# EAGLE design Extrudrboard (EAGLE 6.1)
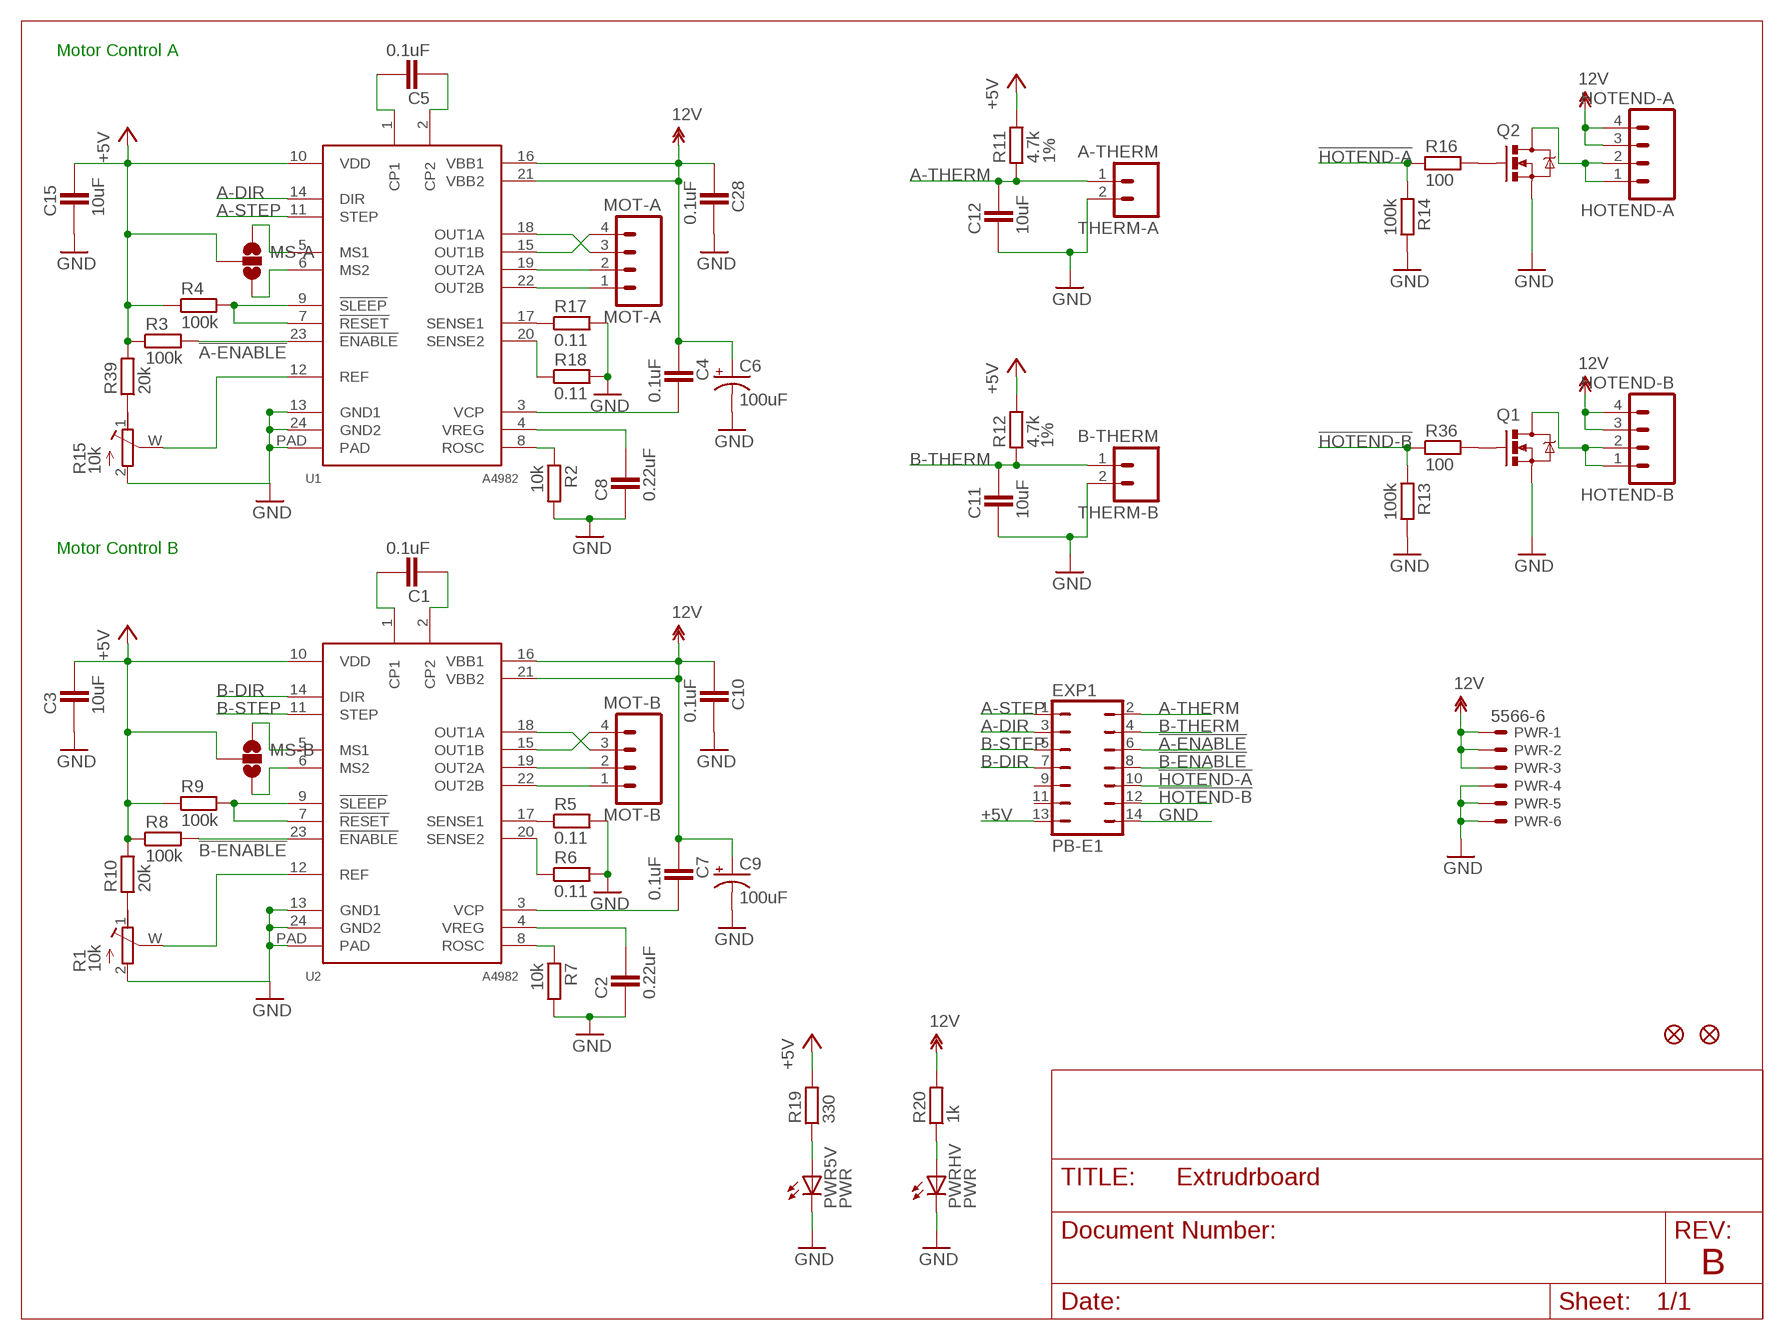
[diagram p0: schematic, sheet 1]

## Parts
C1  0.1uF  CAPACITOR_0805  [CAPC2012X145AN]
C2  0.22uF  CAPACITOR_0805  [CAPC2012X145AN]
C3  10uF  CAPACITOR_0805  [CAPC2012X145AN]
C4  0.1uF  CAPACITOR_0805  [CAPC2012X145AN]
C5  0.1uF  CAPACITOR_0805  [CAPC2012X145AN]
C6  100uF  CPOL-USD  [PANASONIC_D]
C7  0.1uF  CAPACITOR_0805  [CAPC2012X145AN]
C8  0.22uF  CAPACITOR_0805  [CAPC2012X145AN]
C9  100uF  CPOL-USD  [PANASONIC_D]
C10  0.1uF  CAPACITOR_0805  [CAPC2012X145AN]
C11  10uF  CAPACITOR_0805  [CAPC2012X145AN]
C12  10uF  CAPACITOR_0805  [CAPC2012X145AN]
C15  10uF  CAPACITOR_0805  [CAPC2012X145AN]
C28  0.1uF  CAPACITOR_0805  [CAPC2012X145AN]
EXP1  PB-E1  JP7Q  [JP7Q]
HOTEND-A  HOTEND-A  M04POLAR  [MOLEX-1X4]
HOTEND-B  HOTEND-B  M04POLAR  [MOLEX-1X4]
JP1  FIDUCIAL1X2.5  [FIDUCIAL-1X2.5]
JP2  FIDUCIAL1X2.5  [FIDUCIAL-1X2.5]
MOT-A  MOT-A  M04POLAR  [MOLEX-1X4]
MOT-B  MOT-B  M04POLAR  [MOLEX-1X4]
MS-A  SOLDERJUMPER_2WAYCONNECTED  [SJ_3_CONNECTED]
MS-B  SOLDERJUMPER_2WAYCONNECTED  [SJ_3_CONNECTED]
PWR  5566-6  [5566-6]
PWR5V  PWR  LEDCHIP-LED0805  [CHIP-LED0805]
PWRHV  PWR  LEDCHIP-LED0805  [CHIP-LED0805]
Q1  MOSFET-NCHANNELPTH2  [TO220V]
Q2  MOSFET-NCHANNELPTH2  [TO220V]
R1  10k  RTRIM-ST-4EA  [RTRIM-ST4ETB]
R2  10k  RESISTOR_0805  [RESC2012X70N]
R3  100k  RESISTOR_0805  [RESC2012X70N]
R4  100k  RESISTOR_0805  [RESC2012X70N]
R5  0.11  RESISTOR_0805  [RESC2012X70N]
R6  0.11  RESISTOR_0805  [RESC2012X70N]
R7  10k  RESISTOR_0805  [RESC2012X70N]
R8  100k  RESISTOR_0805  [RESC2012X70N]
R9  100k  RESISTOR_0805  [RESC2012X70N]
R10  20k  RESISTOR_0805  [RESC2012X70N]
R11  4.7k  RESISTOR_0805  [RESC2012X70N]
R12  4.7k  RESISTOR_0805  [RESC2012X70N]
R13  100k  RESISTOR_0805  [RESC2012X70N]
R14  100k  RESISTOR_0805  [RESC2012X70N]
R15  10k  RTRIM-ST-4EA  [RTRIM-ST4ETB]
R16  100  RESISTOR_0805  [RESC2012X70N]
R17  0.11  RESISTOR_0805  [RESC2012X70N]
R18  0.11  RESISTOR_0805  [RESC2012X70N]
R19  330  RESISTOR_0805  [RESC2012X70N]
R20  1k  RESISTOR_0805  [RESC2012X70N]
R36  100  RESISTOR_0805  [RESC2012X70N]
R39  20k  RESISTOR_0805  [RESC2012X70N]
THERM-A  A-THERM  M02PTH  [1X02]
THERM-B  B-THERM  M02PTH  [1X02]
U1  A4982  [TSSOP-24]
U2  A4982  [TSSOP-24]

## Nets
12V: C4.1 C6.+ C7.1 C9.+ C10.1 C28.1 HOTEND-A.3 HOTEND-A.4 HOTEND-B.3 HOTEND-B.4 PWR.1 PWR.2 PWR.3 R20.2 U1.16(VBB1) U1.21(VBB2) U2.16(VBB1) U2.21(VBB2)
!A-ENABLE: EXP1.6 R3.2 U1.23(!ENABLE)
!B-ENABLE: EXP1.8 R8.2 U2.23(!ENABLE)
!HOTEND-A: EXP1.10 R14.1 R16.1
!HOTEND-B: EXP1.12 R13.1 R36.1
+5V [power]: C3.2 C15.2 EXP1.13 MS-A.2 MS-B.2 R3.1 R4.1 R8.1 R9.1 R10.2 R11.2 R12.2 R19.2 R39.2 U1.10(VDD) U2.10(VDD)
A-DIR: EXP1.3 U1.14(DIR)
A-STEP: EXP1.1 U1.11(STEP)
A-THERM: C12.2 EXP1.2 R11.1 THERM-A.1
B-DIR: EXP1.7 U2.14(DIR)
B-STEP: EXP1.5 U2.11(STEP)
B-THERM: C11.2 EXP1.4 R12.1 THERM-B.1
GND [power]: C2.1 C3.1 C6.- C8.1 C9.- C10.2 C11.1 C12.1 C15.1 C28.2 EXP1.14 PWR5V.C PWR.4 PWR.5 PWR.6 PWRHV.C Q1.3(S) Q2.3(S) R1.2(E) R2.2 R5.2 R6.2 R7.2 R13.2 R14.2 R15.2(E) R17.2 R18.2 THERM-A.2 THERM-B.2 U1.13(GND1) U1.24(GND2) U1.PAD U2.13(GND1) U2.24(GND2) U2.PAD
HOTENDA-GND [power]: HOTEND-A.1 HOTEND-A.2 Q2.2(D)
HOTENDB-GND [power]: HOTEND-B.1 HOTEND-B.2 Q1.2(D)
N$1: C1.2 U2.1(CP1)
N$2: C1.1 U2.2(CP2)
N$3: R5.1 U2.17(SENSE1)
N$4: R6.1 U2.20(SENSE2)
N$5: R1.W(S) U2.12(REF)
N$6: R7.1 U2.8(ROSC)
N$7: C2.2 U2.4(VREG)
N$8: R9.2 U2.7(!RESET) U2.9(!SLEEP)
N$9: C7.2 U2.3(VCP)
N$10: MOT-A.3 U1.18(OUT1A)
N$11: C5.2 U1.1(CP1)
N$12: C5.1 U1.2(CP2)
N$13: R2.1 U1.8(ROSC)
N$14: R17.1 U1.17(SENSE1)
N$15: R18.1 U1.20(SENSE2)
N$16: C4.2 U1.3(VCP)
N$17: MOT-A.4 U1.15(OUT1B)
N$18: R15.W(S) U1.12(REF)
N$19: C8.2 U1.4(VREG)
N$20: MOT-A.2 U1.19(OUT2A)
N$21: R4.2 U1.7(!RESET) U1.9(!SLEEP)
N$22: MS-B.1 U2.5(MS1)
N$23: MOT-A.1 U1.22(OUT2B)
N$24: MS-B.3 U2.6(MS2)
N$25: MOT-B.3 U2.18(OUT1A)
N$26: MOT-B.4 U2.15(OUT1B)
N$27: MS-A.1 U1.5(MS1)
N$28: MS-A.3 U1.6(MS2)
N$29: MOT-B.2 U2.19(OUT2A)
N$30: MOT-B.1 U2.22(OUT2B)
N$31: R1.1(A) R10.1
N$32: Q2.1(G) R16.2
N$33: PWR5V.A R19.1
N$34: PWRHV.A R20.1
N$69: R15.1(A) R39.1
N$71: Q1.1(G) R36.2
Unconnected: EXP1.9 EXP1.11

## Notes on the sheet
- Motor Control A
- Motor Control B
- B

## Library data of the parts
C1-C5 C7 C8 C10-C12 C15 C28 = ipc-7351-capacitor:CAPACITOR_
C6 C9 = rcl:CPOL-US: POLARIZED CAPACITOR, American symbol
EXP1 = printrbot:JP7Q: JUMPER
HOTEND-A HOTEND-B MOT-A MOT-B = SparkFun:M04: Header 4 Standard 4-pin 0.1" header. Use with straight break away headers (SKU : PRT-00116), right angle break away headers (PRT-00553), swiss pins (PRT-00743), machine pins (PRT-00117), and female headers (PRT-00115). Molex polarized connector foot print use with SKU : PRT-08231 with associated crimp pins and housings. 1MM SMD Version SKU: PRT-10208
JP1 JP2 = SparkFun:FIDUCIAL: Fiducial Alignment Points Various fiducial points for machine vision alignment.
MS-A MS-B = printrbot:SOLDERJUMPER_2WAY: Solder Jumper 2 way solder jumper
PWR = printrbot:5566-6: Mini FIT connector 6 pol Source: http://www.molex.com; MPN: 95566-61002; OC_FARNELL: unknown; OC_NEWARK: 22K8620
PWR5V PWRHV = led:LED: LED OSRAM: - CHIPLED LG R971, LG N971, LY N971, LG Q971, LY Q971, LO R971, LY R971 LH N974, LH R974 LS Q976, LO Q976, LY Q976 LO Q996 - Hyper CHIPLED LW Q18S LB Q993, LB Q99A, LB R99A - SideLED LS A670, LO A670, LY A670, LG A670, LP A670 LB A673, LV A673, LT A673, LW A673 LH A674 LY A675 LS A676, LA A676, LO A676, LY A676, LW A676 LS A679, LY A679, LG A679 - Hyper Micro SIDELED® LS Y876, LA Y876, LO Y876, LY Y876 LT Y87S - SmartLED LW L88C, LW L88S LB L89C, LB L89S, LG L890 LS L89K, LO L89K, LY L89K LS L896, LA L896, LO L896, LY L896 - TOPLED LS T670, LO T670, LY T670, LG T670, LP T670 LSG T670, LSP T670, LSY T670, LOP T670, LYG T670 LG T671, LOG T671, LSG T671 LB T673, LV T673, LT T673, LW T673 LH T674 LS T676, LA T676, LO T676, LY T676, LB T676, LH T676, LSB T676, LW T676 LB T67C, LV T67C, LT T67C, LS T67K, LO T67K, LY T67K, LW E67C LS E67B, LA E67B, LO E67B, LY E67B, LB E67C, LV E67C, LT E67C LW T67C LS T679, LY T679, LG T679 LS T770, LO T770, LY T770, LG T770, LP T770 LB T773, LV T773, LT T773, LW T773 LH T774 LS E675, LA E675, LY E675, LS T675 LS T776, LA T776, LO T776, LY T776, LB T776 LHGB T686 LT T68C, LB T68C - Hyper Mini TOPLED® LB M676 - Mini TOPLED Santana® LG M470 LS M47K, LO M47K, LY M47K Source: http://www.osram.convergy.de LUXEON: - LUMILED® LXK2-PW12-R00, LXK2-PW12-S00, LXK2-PW14-U00, LXK2-PW14-V00 LXK2-PM12-R00, LXK2-PM12-S00, LXK2-PM14-U00 LXK2-PE12-Q00, LXK2-PE12-R00, LXK2-PE12-S00, LXK2-PE14-T00, LXK2-PE14-U00 LXK2-PB12-K00, LXK2-PB12-L00, LXK2-PB12-M00, LXK2-PB14-N00, LXK2-PB14-P00, LXK2-PB14-Q00 LXK2-PR12-L00, LXK2-PR12-M00, LXK2-PR14-Q00, LXK2-PR14-R00 LXK2-PD12-Q00, LXK2-PD12-R00, LXK2-PD12-S00 LXK2-PH12-R00, LXK2-PH12-S00 LXK2-PL12-P00, LXK2-PL12-Q00, LXK2-PL12-R00 Source: www.luxeon.com KINGBRIGHT: KA-3528ASYC Source: www.kingbright.com
Q1 Q2 = SparkFun:MOSFET-NCHANNEL
R1 R15 = printrbot:RTRIM-ST-4EA
R2-R10 R13 R14 R16-R20 R36 R39 = ipc-7351-resistor:RESISTOR_
R11 R12 = ipc-7351-resistor:RESISTOR_; TOLERANCE: 1%
THERM-A THERM-B = SparkFun:M02: Header 2 Standard 2-pin 0.1" header. Use with straight break away headers (SKU : PRT-00116), right angle break away headers (PRT-00553), swiss pins (PRT-00743), machine pins (PRT-00117), and female headers (PRT-00115). Molex polarized connector foot print use with SKU : PRT-08233 with associated crimp pins and housings.
U1 U2 = printrbot:A4982

## Board
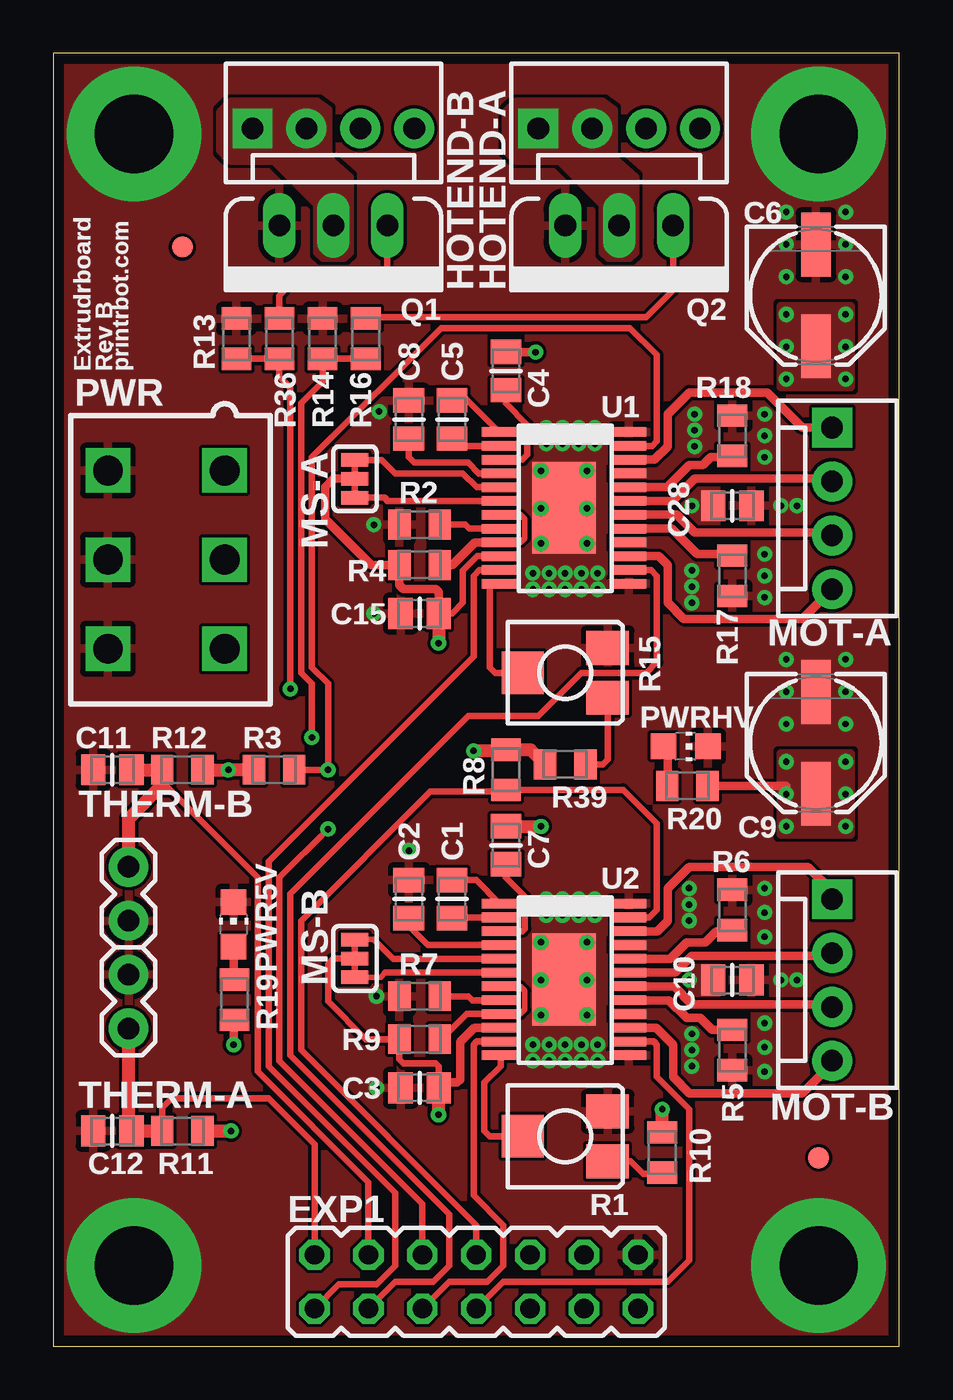
[diagram p1: board, top side]
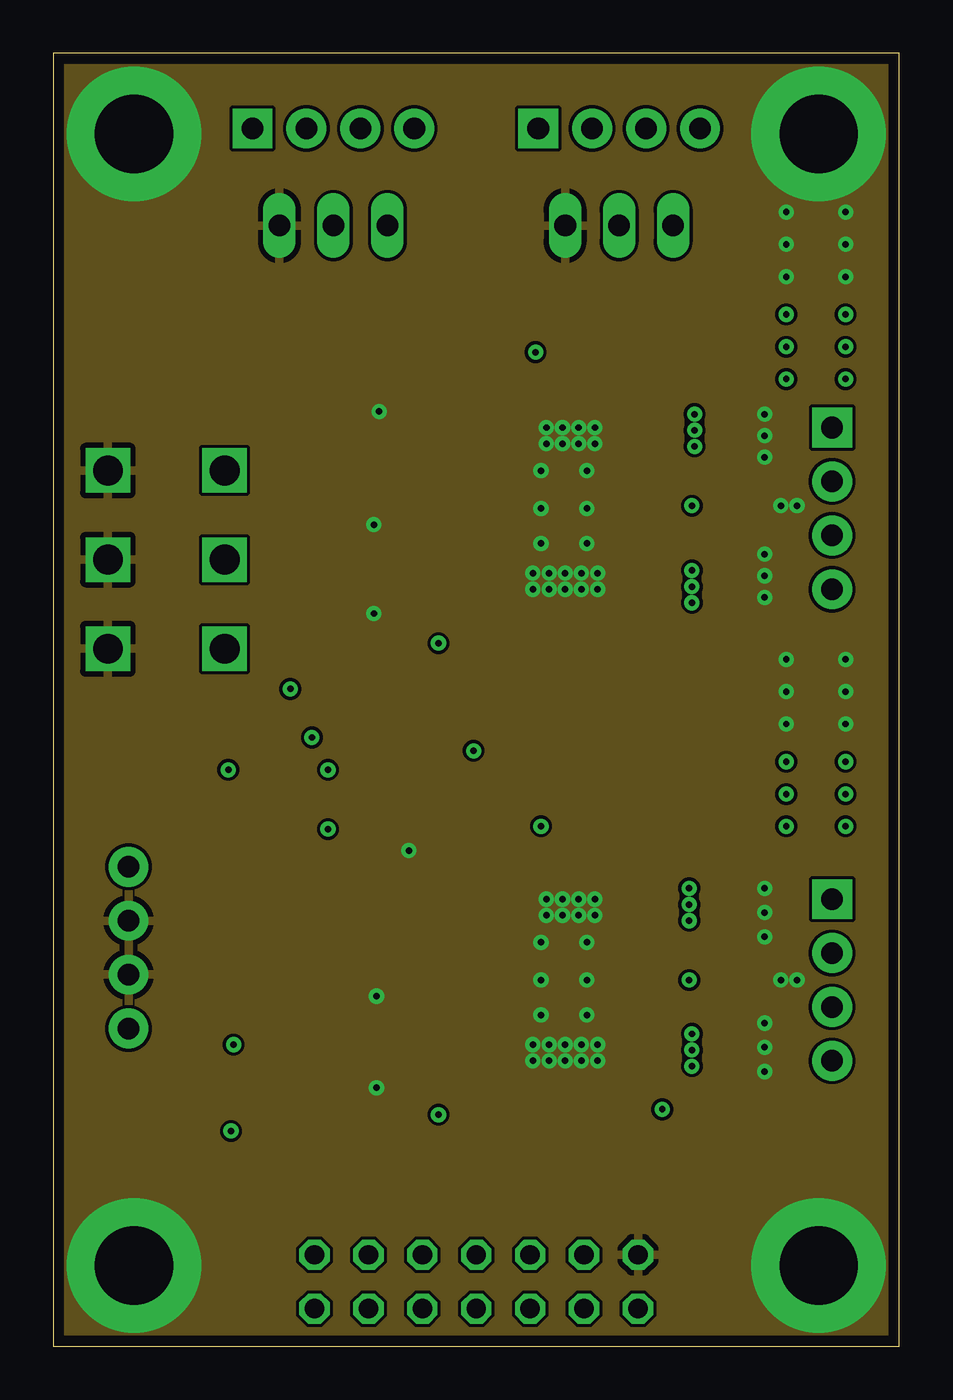
[diagram p2: board, inner layer GND]
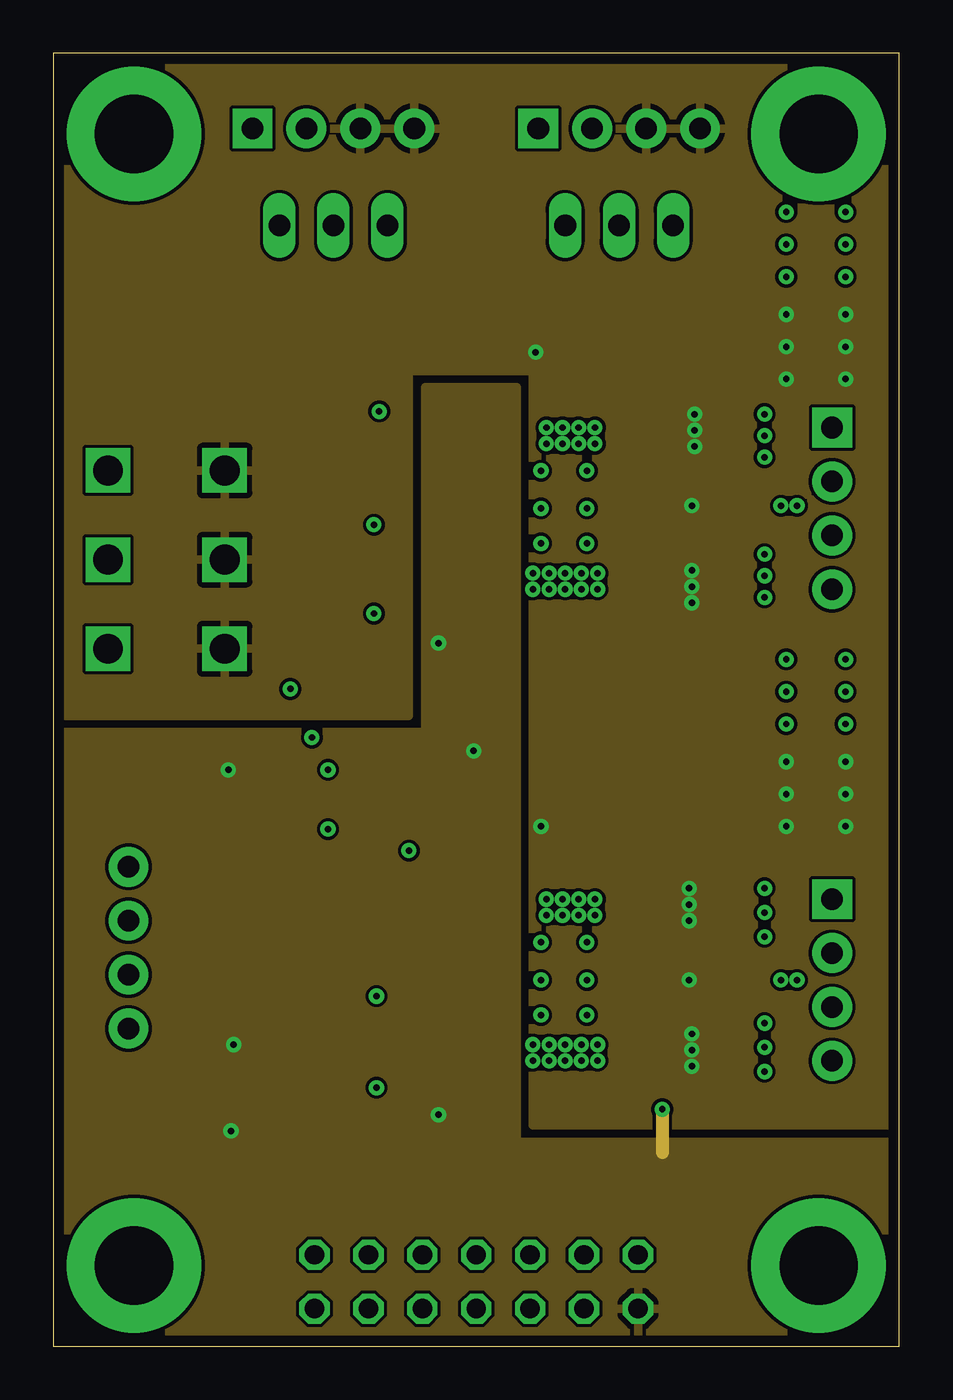
[diagram p3: board, inner layer PWR]
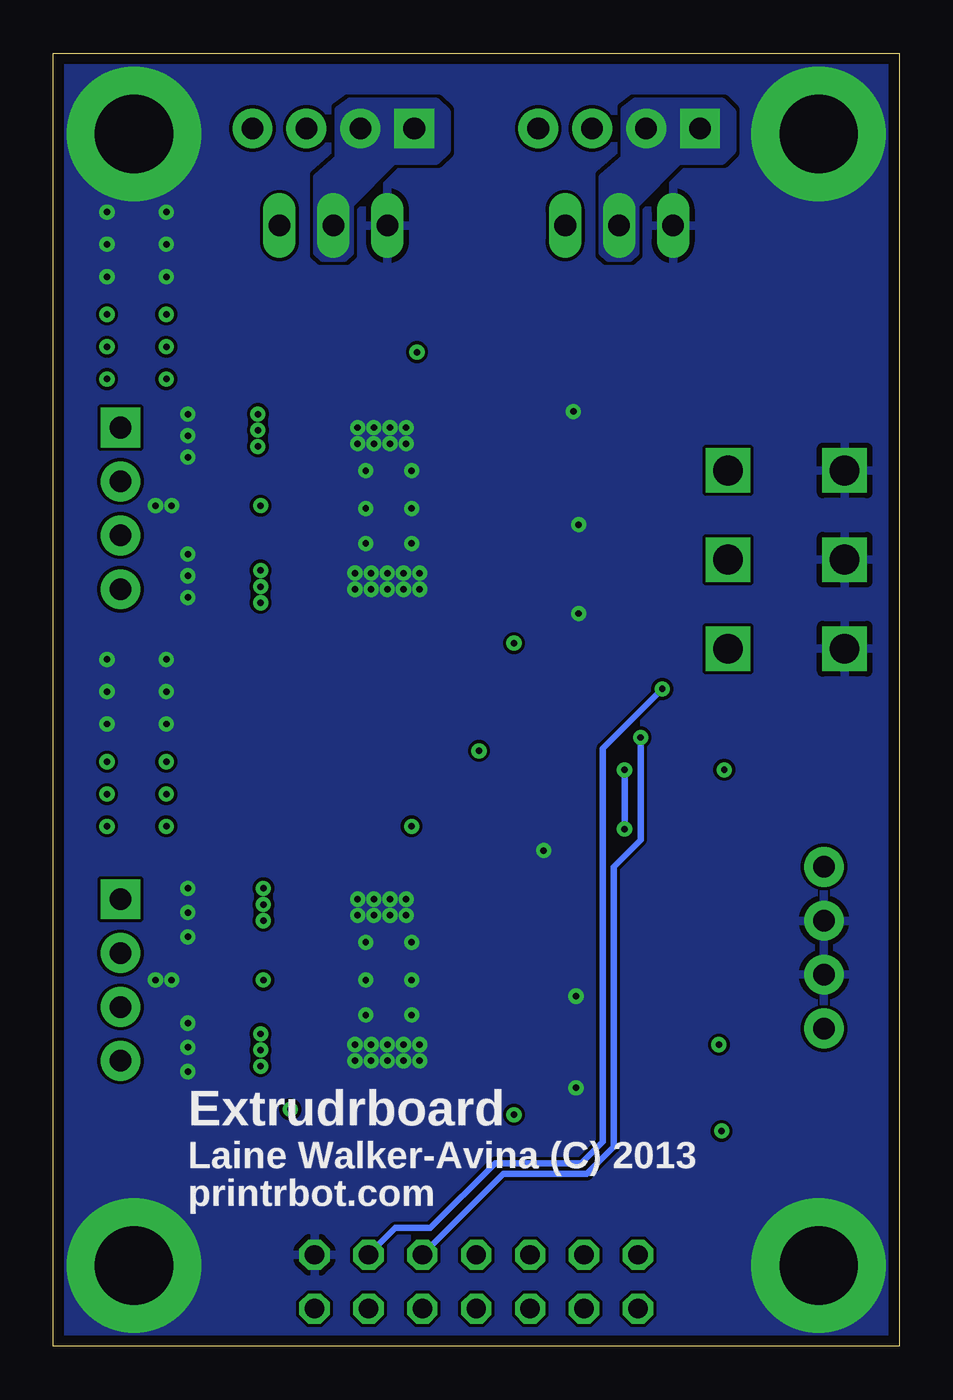
[diagram p4: board, bottom side, seen from below]

Size 39.88 x 60.96 mm. Coordinates in mm from the lower left corner, seen from the top.
Outline: 0,0 39.88,0 39.88,60.96 0,60.96 0,0
Copper layers (1*2+3*16): Top 0.035mm / dielectric 0.6mm / GND 0.035mm / dielectric 0.2mm / PWR 0.035mm / dielectric 0.6mm / Bottom 0.035mm
Design rules: minimum track width 6mil, minimum drill 12mil, track to track 6mil, track to pad 7mil, pad to pad 6mil, via to via 6mil, smd to smd 0mil, copper to edge 20mil, drill to drill 10mil, minimum pad ring 10mil, minimum via ring 8mil, stop-mask expansion 6mil, vias tented up to drill 100mil, thermal gap 10mil

### Footprints (pad centres in the part's own frame; a part is rotated, then mirrored left to right if it is on the bottom)
CAPC2012X145AN = smd 1.15 x 1.45: 1 -0.9,0; 2 0.9,0
PANASONIC_D = smd 3 x 1.4: + 2.4,0; - -2.4,0
JP7Q = drill 0.914 octagon: 1 -7.62,-1.27; 2 -7.62,1.27; 3 -5.08,-1.27; 4 -5.08,1.27; 5 -2.54,-1.27; 6 -2.54,1.27; 7 0,-1.27; 8 0,1.27; 9 2.54,-1.27; 10 2.54,1.27; 11 5.08,-1.27; 12 5.08,1.27; 13 7.62,-1.27; 14 7.62,1.27
MOLEX-1X4 = drill 1.016 pad 1.88 square: 1 0,0 | drill 1.016 pad 1.88: 2 2.54,0; 3 5.08,0; 4 7.62,0
FIDUCIAL-1X2.5 = smd 1 x 1: 1 0,0
SJ_3_CONNECTED = smd 0.635 x 1.27: 1 -0.889,0; 2 0,0; 3 0.889,0
5566-6 = drill 1.4 square: 1 4.2,-2.75; 2 0,-2.75; 3 -4.2,-2.75; 4 4.2,2.75; 5 0,2.75; 6 -4.2,2.75
CHIP-LED0805 = smd 1.2 x 1.2: A 0,-1.05; C 0,1.05
TO220V = drill 1.016 long: 1 -2.54,0; 2 0,0; 3 2.54,0
RTRIM-ST4ETB = smd 1.6 x 2: 1 -1.175,-2; 2 1.175,-2 | smd 2 x 2: W 0,2
RESC2012X70N = smd 1.05 x 1.4: 1 -0.95,0; 2 0.95,0
1X02 = drill 1.016 pad 1.88: 1 0,0; 2 2.54,0
TSSOP-24 = smd 0.45 x 1.65: 1 -3.6,-3.1; 2 -2.95,-3.1; 3 -2.3,-3.1; 4 -1.65,-3.1; 5 -1,-3.1; 6 -0.35,-3.1; 7 0.3,-3.1; 8 0.95,-3.1; 9 1.6,-3.1; 10 2.25,-3.1; 11 2.9,-3.1; 12 3.55,-3.1; 13 3.55,3; 14 2.9,3; 15 2.25,3; 16 1.6,3; 17 0.95,3; 18 0.3,3; 19 -0.35,3; 20 -1,3; 21 -1.65,3; 22 -2.3,3; 23 -2.95,3; 24 -3.6,3 | smd 4.32 x 3: PAD -0.025,-0.05

### Placement (x,y rotation side)
C1  18.8,21.08 90 top
C2  16.76,21.08 270 top
C3  17.27,12.19 0 top
C4  21.34,45.97 270 top
C5  18.8,43.69 90 top
C6  35.94,49.53 270 top
C7  21.34,23.62 270 top
C8  16.76,43.69 270 top
C9  35.94,28.45 270 top
C10  32,17.27 0 top
C11  2.79,27.18 0 top
C12  2.79,10.16 0 top
C15  17.27,34.54 0 top
C28  32,39.62 0 top
EXP1  19.94,3.05 0 top
HOTEND-A  22.86,57.4 0 top
HOTEND-B  9.4,57.4 0 top
JP1  36.07,8.89 0 top
JP2  6.1,51.82 0 top
MOT-A  36.7,43.31 270 top
MOT-B  36.7,21.08 270 top
MS-A  14.22,40.89 270 top
MS-B  14.22,18.29 270 top
PWR  5.33,37.08 90 top
PWR5V  8.51,19.9 0 top
PWRHV  29.81,28.28 270 top
Q1  13.21,52.83 180 top
Q2  26.67,52.83 180 top
R1  24.13,9.91 90 top
R2  17.27,38.73 180 top
R3  10.41,27.18 0 top
R4  17.27,36.83 0 top
R5  32,13.97 270 top
R6  32,20.57 90 top
R7  17.27,16.51 180 top
R8  21.34,27.18 270 top
R9  17.27,14.48 0 top
R10  28.7,9.14 90 top
R11  6.1,10.16 0 top
R12  6.1,27.18 0 top
R13  8.64,47.5 90 top
R14  12.7,47.5 90 top
R15  24.13,31.75 90 top
R16  14.73,47.5 90 top
R17  32,36.32 270 top
R18  32,42.93 90 top
R19  8.55,16.34 270 top
R20  29.89,26.42 0 top
R36  10.67,47.5 90 top
R39  24.13,27.43 180 top
THERM-A  3.56,14.99 90 top
THERM-B  3.56,22.61 270 top
U1  24.13,39.5 270 top
U2  24.13,17.27 270 top

### Tracks (layer width: path | path; a pad name or v marks a point on that pad's centre or on a via)
12V  (via drill 0.3)
  Top 0.305: C7.1
  Top 0.406: C4.1 22.72,46.87 v22.73,46.86 | R20.2 34.54,26.42 v34.54,26.04
  Top 0.61: C7.1 v22.99,24.51
  other vias: 29.97,17.27 30.1,14.73 30.1,13.21 30.1,13.97 29.97,20.07 29.97,20.83 29.97,21.59 30.1,36.58 30.1,35.81 30.1,35.05 30.1,39.62 30.23,43.18 34.54,27.56 34.54,24.51 37.34,27.56 37.34,26.04 37.34,24.51 34.54,48.64 34.54,47.12 34.54,45.59 37.34,48.64 37.34,47.12 37.34,45.59 30.23,43.94 30.23,42.42
  pour PWR: 0,29.72 0,29.72 16.76,29.72 16.76,45.97 22.61,45.97 22.61,10.41 39.88,10.41 39.88,60.96 0,60.96
  pour Top (no thermals): 31.24,22.61 29.97,22.61 28.96,21.59 28.96,20.07 28.45,19.56 26.42,19.56 26.42,14.99 28.45,14.99 29.21,14.22 29.21,12.7 29.97,11.94 31.24,11.94
  pour Top (no thermals): 31.24,44.58 29.97,44.58 28.96,43.56 28.96,42.04 28.45,41.53 26.42,41.53 26.42,36.96 28.45,36.96 29.21,36.2 29.21,35.18 30.23,34.42 31.24,34.42
  pour Top (no thermals): 34.29,27.94 37.59,27.94 37.59,24.13 34.29,24.13
  pour Top (no thermals): 34.29,49.02 37.59,49.02 37.59,45.21 34.29,45.21
!A-ENABLE  (via drill 0.3)
  Top 0.305: U1.23 28.22,42.45 28.45,42.67 28.45,46.74 27.18,48.01 18.29,48.01 12.19,41.91 12.19,32 12.95,31.24 v12.95,27.18 R3.2 | v12.95,24.38 10.67,22.1 10.67,13.46 17.4,6.73 EXP1.6
  Bottom 0.305: v12.95,24.38 v12.95,27.18
!B-ENABLE
  Top 0.305: U2.23 28.1,20.22 28.45,20.57 28.45,24.64 26.86,26.23 R8.2 21.34,26.16 17.78,26.16 11.68,20.07 11.68,13.97 19.94,5.71 EXP1.8
!HOTEND-A  (via drill 0.3)
  Top 0.305: R16.1 R14.1 12.7,45.47 11.68,44.45 11.68,31.75 12.19,31.24 v12.19,28.7
  Bottom 0.305: EXP1.10 18.67,8.13 14.73,8.13 13.46,9.4 13.46,22.61 12.19,23.88 v12.19,28.7
!HOTEND-B  (via drill 0.3)
  Top 0.305: R13.1 R36.1 10.67,45.72 11.18,45.21 v11.18,30.99
  Bottom 0.305: EXP1.12 23.75,5.59 22.1,5.59 19.05,8.64 14.99,8.64 13.97,9.65 13.97,28.19 v11.18,30.99
+5V  (via drill 0.3)
  Top 0.305: 18.16,12.44 18.16,13.21 18.03,13.34 16.51,13.34 16.32,13.52 R9.1 14.73,14.48 12.95,16.26 12.95,18.03 13.21,18.29 MS-B.2 | U1.10 19.98,37.25 19.3,36.58 19.3,35.05 18.8,34.54 C15.2 | R8.1 21.27,28.07 | C15.2 | 18.16,34.55 C15.2 | C3.2 18.29,12.31 18.29,12.45
  Top 0.406: U2.10 19.85,15.02 19.18,14.35 19.18,12.57 19.05,12.45 18.29,12.45 | C3.2 18.16,12.44 | MS-A.2 13.21,40.89 12.83,40.51 12.83,38.99 14.99,36.83 R4.1 16.32,35.88 16.51,35.69 18.03,35.69 18.16,35.56 18.16,34.55 | 18.17,33.16 v18.16,33.15 | R19.2 8.51,15.35 v8.51,14.22
  Top 0.61: v18.16,10.92 C3.2 | R10.2 v28.7,11.18 | R3.1 v8.26,27.18 R12.2 | R8.1 22.48,28.13 R39.2 | 21.27,28.07 v19.81,28.07 | R11.2 v8.38,10.16 | C15.2 18.17,33.16
  PWR 0.61: v28.7,11.18 28.7,9.14
  pour PWR: 17.53,45.21 17.53,28.96 0,28.96 0,0 39.88,0 39.88,9.65 21.84,9.65 21.84,45.21
A-DIR
  Top 0.305: U1.14 28.17,36.6 28.45,36.32 28.45,32.26 27.94,31.75 24.89,31.75 22.86,29.72 19.56,29.72 11.18,21.34 11.18,13.72 18.67,6.22 18.67,3.81 17.91,3.05 16.13,3.05 EXP1.3
A-STEP
  Top 0.305: U1.11 20.09,36.6 19.81,36.32 19.81,32.51 10.16,22.86 10.16,13.21 16.13,7.24 16.13,3.81 15.24,2.92 13.46,2.92 EXP1.1
A-THERM
  Top 0.305: C12.2 3.56,10.3 | EXP1.2 12.32,9.53 10.16,11.68 5.59,11.68 5.15,11.24 R11.1
  Top 0.61: C12.2 R11.1 | 3.56,10.3 THERM-A.1
B-DIR
  Top 0.305: U2.14 28.3,14.37 28.45,14.22 28.45,12.7 29.97,11.18 29.97,4.06 28.96,3.05 21.21,3.05 EXP1.7
B-STEP
  Top 0.305: U2.11 19.96,14.37 19.81,14.22 19.81,7.11 21.21,5.71 21.21,3.81 20.45,3.05 18.67,3.05 EXP1.5
B-THERM
  Top 0.305: 5.08,26.42 5.08,26.92 5.33,27.18 R12.1 5.33,26.99 5.33,26.42 9.65,22.1 9.65,12.95 14.86,7.75 EXP1.4
  Top 0.61: THERM-B.1 3.56,24.89 5.08,26.42 | C11.2 R12.1
GND  (via drill 0.3, 3.68 pad 6.35)
  other vias: 3.81,57.15 36.07,57.15 36.07,3.81 3.81,3.81 22.61,14.22 22.61,13.46 23.37,13.46 23.37,14.22 24.13,14.22 24.89,14.22 25.65,14.22 24.13,13.46 24.89,13.46 25.65,13.46 22.99,17.27 25.15,17.27 25.15,19.05 22.99,19.05 22.99,15.62 25.15,15.62 23.24,20.32 23.24,21.08 24,21.08 24.77,21.08 25.53,21.08 24,20.32 24.77,20.32 25.53,20.32 34.54,30.86 34.54,29.34 37.34,29.34 37.34,32.38 34.54,32.38 37.34,30.86 22.61,36.45 22.61,35.69 23.37,35.69 23.37,36.45 24.13,36.45 24.89,36.45 25.65,36.45 24.13,35.69 24.89,35.69 25.65,35.69 22.99,39.5 25.15,39.5 25.15,41.27 22.99,41.27 22.99,37.85 25.15,37.85 23.24,42.55 23.24,43.31 24,43.31 24.77,43.31 25.53,43.31 24,42.55 24.77,42.55 25.53,42.55 33.53,15.24 33.53,14.1 33.53,12.95 33.53,19.3 33.53,20.45 33.53,21.59 34.29,17.27 35.05,17.27 15.24,16.51 16.76,23.37 33.53,37.34 33.53,36.32 33.53,35.31 34.29,39.62 33.53,42.93 34.54,53.47 34.54,51.94 34.54,50.42 37.34,53.47 37.34,51.94 37.34,50.42 15.37,44.07 15.11,38.73 15.11,34.54 15.24,12.19 33.53,43.94 33.53,41.91 35.05,39.62
  pour Top (rank 5): 0,60.96 39.88,60.96 39.88,0 0,0
  pour Bottom (rank 5): 0,60.96 39.88,60.96 39.88,0 0,0
  pour GND: 0,60.96 39.88,60.96 39.88,0 0,0
  pour Top (no thermals): 34.29,32.51 37.59,32.51 37.59,29.21 34.29,29.21
HOTENDA-GND
  pour Top (no thermals): 25.91,53.85 25.91,51.56 26.16,51.31 27.18,51.31 27.43,51.56 27.43,55.12 26.42,56.01 26.42,58.29 25.91,58.67 21.84,58.67 21.34,58.17 21.34,56.39 21.84,55.88 23.88,55.88
  pour Bottom (no thermals): 25.91,53.85 25.91,51.56 26.16,51.31 27.18,51.31 27.43,51.56 27.43,55.12 26.42,56.01 26.42,58.29 25.91,58.67 21.84,58.67 21.34,58.17 21.34,56.39 21.84,55.88 23.88,55.88
HOTENDB-GND
  pour Top (no thermals): 12.45,53.85 12.45,51.56 12.7,51.31 13.72,51.31 13.97,51.56 13.97,55.12 12.95,56.01 12.95,58.29 12.45,58.67 8.38,58.67 7.87,58.17 7.87,56.39 8.38,55.88 10.41,55.88
  pour Bottom (no thermals): 12.45,53.85 12.45,51.56 12.7,51.31 13.72,51.31 13.97,51.56 13.97,55.12 12.95,56.01 12.95,58.29 12.45,58.67 8.38,58.67 7.87,58.17 7.87,56.39 8.38,55.88 10.41,55.88
N$1
  Top 0.305: U2.1 19.93,21.98 C1.2
N$2
  Top 0.305: U2.2 18.76,20.22 C1.1
N$3
  Top 0.406: U2.17 29.02,16.32 29.84,15.49 30.48,15.49 31.05,14.92 R5.1
N$4
  Top 0.406: U2.20 29.07,18.27 29.84,19.05 30.73,19.05 31.24,19.56 32,19.56 R6.1
N$5
  Top 0.305: R1.W 20.57,9.91 20.32,10.16 20.32,12.45 21.08,13.21 21.08,13.67 U2.12
N$6
  Top 0.305: U2.8 19.75,16.32 19.56,16.51 R7.1
N$7
  Top 0.254: 17.65,18.92 16.76,19.81
  Top 0.305: U2.4 17.65,18.92 | 16.76,19.81 16.76,20.07 C2.2 16.76,20.57
N$8
  Top 0.254: U2.9 22.02,15.67 22.23,15.88 22.23,16.76 22.02,16.97 U2.7
  Top 0.305: U2.9 19.48,15.67 18.29,14.48 R9.2
N$9
  Top 0.305: U2.3 22.11,19.57 22.23,19.68 22.23,21.21 21.34,22.1 C7.2
N$10
  Top 0.406: U1.18 29.38,39.2 30.23,38.35 36.58,38.35 MOT-A.3
N$11
  Top 0.305: U1.1 19.42,44.7 18.8,44.7 C5.2
N$12
  Top 0.305: U1.2 19.14,42.45 C5.1
N$13
  Top 0.305: U1.8 19.62,38.55 19.43,38.73 R2.1
N$14
  Top 0.406: U1.17 29.14,38.55 30.35,37.34 31.94,37.34 R17.1
N$15
  Top 0.305: R18.1 32,41.91
  Top 0.406: U1.20 28.94,40.5 29.97,41.53 30.61,41.53 30.99,41.91 32,41.91
N$16
  Top 0.305: U1.3 22.11,41.8 22.35,42.04 22.35,43.43 21.34,44.45 C4.2
N$17
  Top 0.406: U1.15 28.54,37.25 28.96,36.83 28.96,35.05 29.72,34.29 35.31,34.29 MOT-A.4
N$18
  Top 0.305: U1.12 20.57,35.95 20.57,32 20.83,31.75 R15.W
N$19
  Top 0.305: U1.4 20.07,41.15 19.56,41.66 17.02,41.66 16.76,41.91 C8.2
N$20
  Top 0.406: U1.19 29.18,39.85 30.23,40.89 36.32,40.89 36.58,40.64 MOT-A.2
N$21
  Top 0.254: U1.9 22.02,37.9 22.23,38.1 22.23,38.99 22.02,39.2 U1.7
  Top 0.305: 18.54,36.83 18.8,36.83
  Top 0.406: R4.2 18.54,36.83 | U1.9 19.86,37.9 18.8,36.83
N$22
  Top 0.254: MS-B.1 15.11,19.18 16.02,18.27
  Top 0.305: U2.5 16.02,18.27
N$23
  Top 0.406: U1.22 28.34,41.8 28.96,42.42 28.96,43.94 29.97,44.96 33.66,44.96 35.31,43.31 MOT-A.1
N$24
  Top 0.254: MS-B.3 15.43,17.4 15.65,17.62
  Top 0.305: U2.6 15.65,17.62
N$25
  Top 0.406: U2.18 29.26,16.97 30.1,16.13 36.58,16.13 MOT-B.3
N$26
  Top 0.305: 36.58,13.21 36.58,13.34 MOT-B.4
  Top 0.406: U2.15 28.41,15.02 29.21,14.22 29.21,12.7 29.97,11.94 35.31,11.94 36.58,13.21 | MOT-B.4 36.7,13.34
N$27
  Top 0.305: MS-A.1 15.48,41.78 16.11,41.15 19.3,41.15 19.95,40.5 U1.5
N$28
  Top 0.305: U1.6 15.75,39.85 15.75,39.88 15.62,40.01 MS-A.3
N$29
  Top 0.305: 36.58,18.41 MOT-B.2
  Top 0.406: U2.19 29.31,17.62 30.1,18.41 36.58,18.41
N$30
  Top 0.406: U2.22 28.46,19.57 28.96,20.07 28.96,21.59 29.97,22.61 35.56,22.61 36.7,21.46 MOT-B.1
N$31
  Top 0.305: R1.1 27.21,8.73 27.81,8.13 28.7,8.13 R10.1
N$32
  Top 0.305: R16.2 14.8,48.51 27.94,48.51 29.21,49.78 Q2.1
N$33
  Top 0.406: R19.1 8.51,17.33 PWR5V.A
N$34
  Top 0.406: PWRHV.A 28.96,28.28 28.96,26.42 | R20.1 28.96,26.42 | 28.96,26.42
N$69
  Top 0.305: R15.1 26.13,27.65 25.91,27.43 R39.1
N$71
  Top 0.305: R36.2 10.67,49.53 11.18,50.04 14.99,50.04 15.75,50.8 Q1.1

### Text on the board
bPlace: Extrudrboard | Laine Walker-Avina (C) 2013 | printrbot.com
tNames: Extrudrboard | Rev B | printrbot.com
_tsilk: C6 | HOTEND-B | HOTEND-A | Q1 | Q2 | Extrudrboard | Rev B | printrbot.com | R13 | R36 | R14 | R16 | C8 | C5 | R18 | PWR | C4 | U1 | R2 | MS-A | C28 | R4 | C15 | R17 | R15 | MOT-A | PWRHV | C11 | R12 | R3 | R8 | R39 | THERM-B | R20 | C7 | C9 | PWR5V | C2 | C1 | U2 | R6 | R19 | R7 | MS-B | C10 | R9 | C3 | R5 | THERM-A | MOT-B | C12 | R11 | R10 | R1 | EXP1
_bsilk: Extrudrboard | Laine Walker-Avina (C) 2013 | printrbot.com